# EAGLE schematic Balancing Circuit Module (EAGLE 5.12)
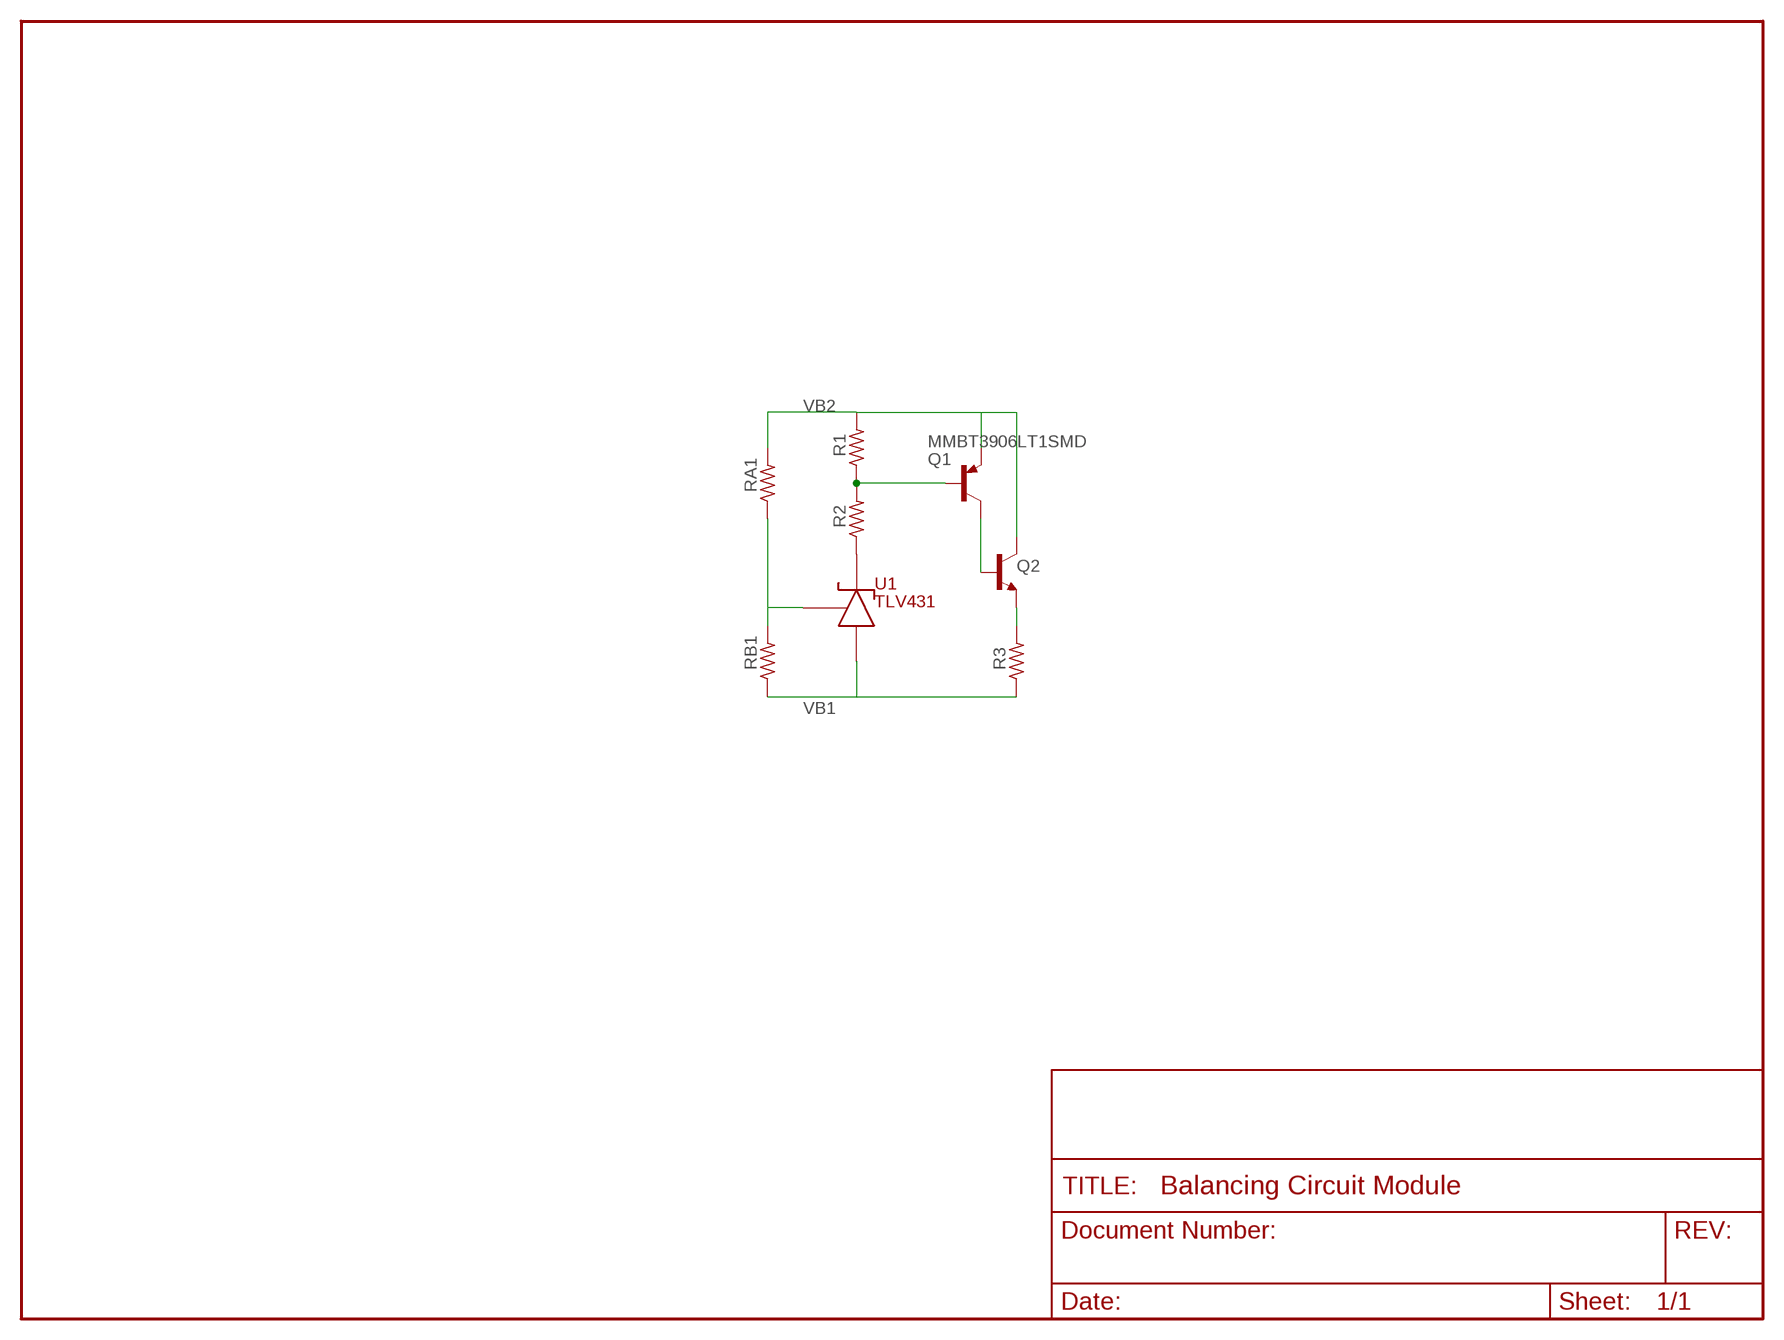
[diagram p0: schematic, sheet 1]

## Parts
Q1  MMBT3906LT1SMD  [SOT23-BEC]
Q2  -NPN-TO220V  [TO220V]
R1  R-US_R0603  [R0603]
R2  R-US_R0603  [R0603]
R3  R-US_R0603  [R0603]
RA1  R-US_R0603  [R0603]
RB1  R-US_R0603  [R0603]
U1  TLV431  [SOT-23-5_(DBV-R-PDSO-G5)]

## Nets
N$50: RA1.1 RB1.2 U1.4(P$2.REF)
N$53: Q2.3(E) R3.2
N$54: Q1.C Q2.1(B)
N$55: Q1.B R1.1 R2.2
N$56: R2.1 U1.3(P$1.CATHODE)
VB1: R3.1 RB1.1 U1.5(P$3.ANODE)
VB2: Q1.E Q2.2(C) R1.2 RA1.2

## Library data of the parts
Q1 = transistor-pnp:MMBT3906*: PNP Transistror
Q2 = transistor:*-NPN-: NPN Transistror BF959 corrected 2008.03.06
R1-R3 RA1 RB1 = resistor:R-US_: RESISTOR, American symbol
U1 = TI:TLV431: TLV431 Low-Voltage Adjustable Precision Shunt Regulator